# EAGLE design UltrasonicSensor (EAGLE 9.2.2)
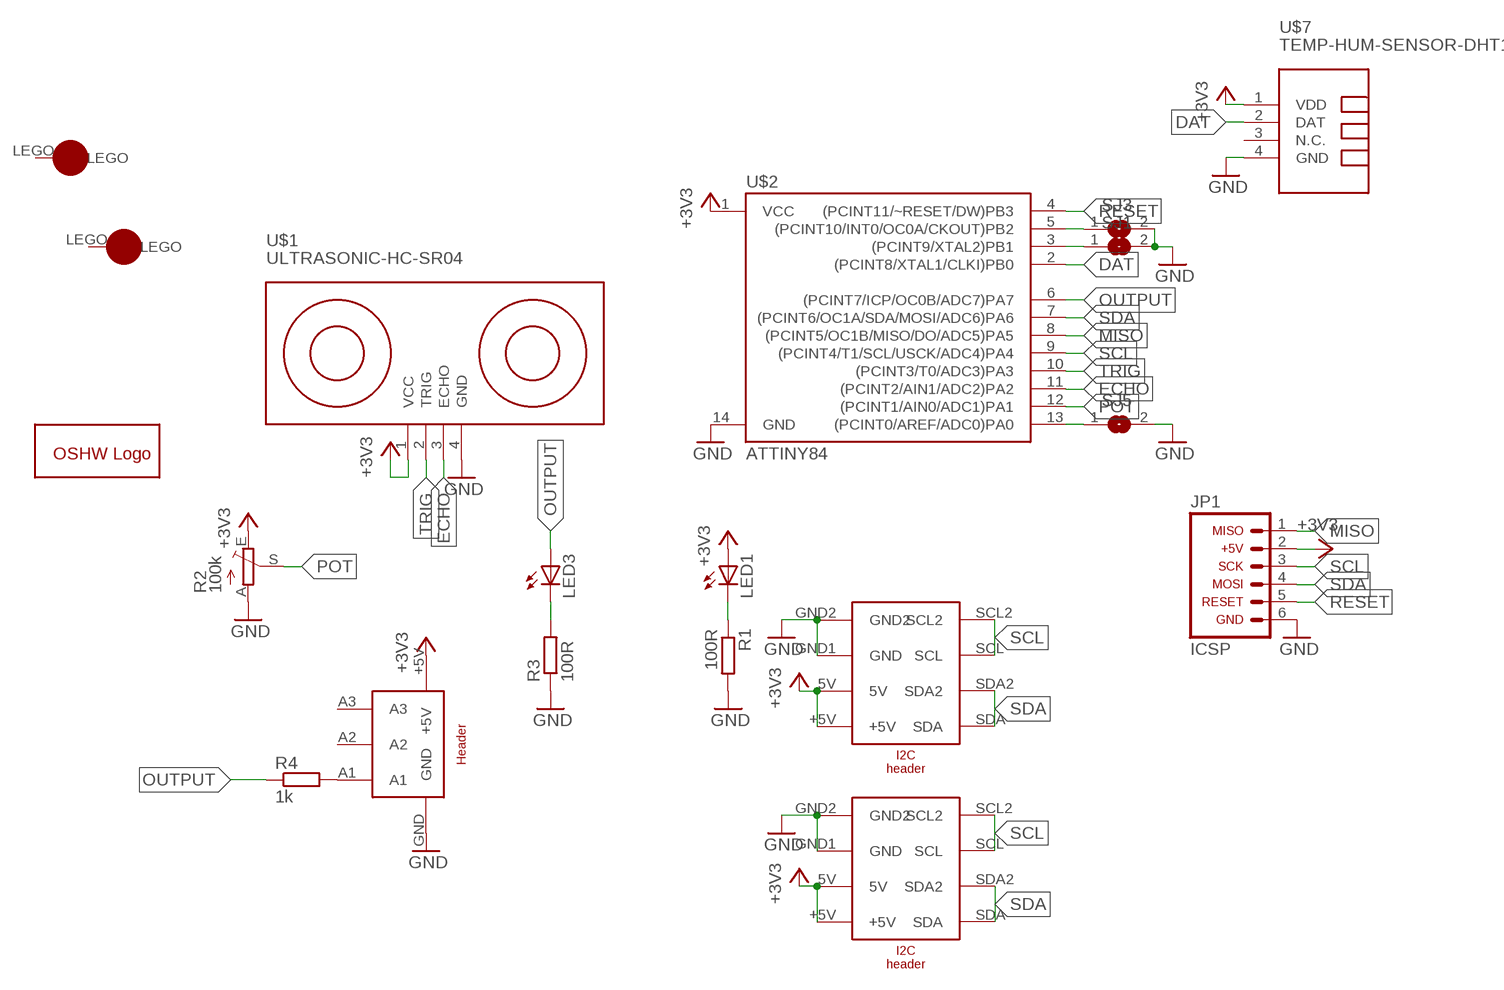
[diagram p0: schematic, sheet 1]

## Parts
JP1  ICSP_HEADER  [ICSP_HEADER]
LED1  LEDCHIPLED_1206  [CHIPLED_1206]
LED3  LEDCHIPLED_1206  [CHIPLED_1206]
R1  100R  R-EU_M1206  [M1206]
R2  100k  TRIM_EU-B64Y  [B64Y]
R3  100R  R-EU_M1206  [M1206]
R4  1k  R-EU_M1206  [M1206]
SJ1  SJ  [SJ]
SJ3  SJ  [SJ]
SJ5  SJ  [SJ]
U$1  ULTRASONIC-HC-SR04  [ULTRASONIC-HC-SR04]
U$2  ATTINY84  [SO14]
U$3  I2C_HEADER  [I2_HEADER]
U$4  I2C_HEADER  [I2_HEADER]
U$5  OPENSOURCE  [OSHW_5MM]
U$6  CONNECTOR_1X5  [CONNECTOR_1X5]
U$7  TEMP-HUM-SENSOR-DHT11  [TEMP-HUM-SENSOR-DHT11]
U$8  LEGO-1X1  [LEGO-1X1]
U$9  LEGO-1X1  [LEGO-1X1]

## Nets
0: SJ5.1 U$2.13((PCINT0/AREF/ADC0)PA0)
8: SJ3.1 U$2.5((PCINT10/INT0/OC0A/CKOUT)PB2)
9: SJ1.1 U$2.3((PCINT9/XTAL2)PB1)
+3V3: JP1.2 LED1.A R2.E U$1.1(VCC) U$2.1(VCC) U$3.5V U$3.+5V U$4.5V U$4.+5V U$6.+5V U$7.1(VDD)
DAT: U$2.2((PCINT8/XTAL1/CLKI)PB0) U$7.2(DAT)
ECHO: U$1.3(ECHO) U$2.11((PCINT2/AIN1/ADC2)PA2)
GND: JP1.6 R1.2 R2.A R3.1 SJ1.2 SJ3.2 SJ5.2 U$1.4(GND) U$2.14(GND) U$3.GND1(GND) U$3.GND2 U$4.GND1(GND) U$4.GND2 U$6.GND U$7.4(GND)
MISO: JP1.1 U$2.8((PCINT5/OC1B/MISO/DO/ADC5)PA5)
N$1: R4.2 U$6.A1
N$10: LED1.C R1.1
N$11: LED3.C R3.2
OUTPUT: LED3.A R4.1 U$2.6((PCINT7/ICP/OC0B/ADC7)PA7)
POT: R2.S U$2.12((PCINT1/AIN0/ADC1)PA1)
RESET: JP1.5 U$2.4((PCINT11/~RESET/DW)PB3)
SCL: JP1.3 U$2.9((PCINT4/T1/SCL/USCK/ADC4)PA4) U$3.SCL U$3.SCL2 U$4.SCL U$4.SCL2
SDA: JP1.4 U$2.7((PCINT6/OC1A/SDA/MOSI/ADC6)PA6) U$3.SDA U$3.SDA2 U$4.SDA U$4.SDA2
TRIG: U$1.2(TRIG) U$2.10((PCINT3/T0/ADC3)PA3)
Unconnected: U$6.A2 U$6.A3 U$7.3(N.C.) U$8.LEGO U$9.LEGO

## Library data of the parts
JP1 = Cing Library:ICSP_HEADER: Arduino ICSP I/O Header This is the ICSP I/O header on the Arduino Uno R3. This connector is labeled with the following pin assignments: MISO +5V SCK MOSI RESET GND NOTE: Be sure you install this connector with the correct orientation on your PCB layout. Pin 1 has a square pad to assist with orientation.
LED1 LED3 = led:LED: LED OSRAM: - CHIPLED LG R971, LG N971, LY N971, LG Q971, LY Q971, LO R971, LY R971 LH N974, LH R974 LS Q976, LO Q976, LY Q976 LO Q996 - Hyper CHIPLED LW Q18S LB Q993, LB Q99A, LB R99A - SideLED LS A670, LO A670, LY A670, LG A670, LP A670 LB A673, LV A673, LT A673, LW A673 LH A674 LY A675 LS A676, LA A676, LO A676, LY A676, LW A676 LS A679, LY A679, LG A679 - Hyper Micro SIDELED® LS Y876, LA Y876, LO Y876, LY Y876 LT Y87S - SmartLED LW L88C, LW L88S LB L89C, LB L89S, LG L890 LS L89K, LO L89K, LY L89K LS L896, LA L896, LO L896, LY L896 - TOPLED LS T670, LO T670, LY T670, LG T670, LP T670 LSG T670, LSP T670, LSY T670, LOP T670, LYG T670 LG T671, LOG T671, LSG T671 LB T673, LV T673, LT T673, LW T673 LH T674 LS T676, LA T676, LO T676, LY T676, LB T676, LH T676, LSB T676, LW T676 LB T67C, LV T67C, LT T67C, LS T67K, LO T67K, LY T67K, LW E67C LS E67B, LA E67B, LO E67B, LY E67B, LB E67C, LV E67C, LT E67C LW T67C LS T679, LY T679, LG T679 LS T770, LO T770, LY T770, LG T770, LP T770 LB T773, LV T773, LT T773, LW T773 LH T774 LS E675, LA E675, LY E675, LS T675 LS T776, LA T776, LO T776, LY T776, LB T776 LHGB T686 LT T68C, LB T68C - Hyper Mini TOPLED® LB M676 - Mini TOPLED Santana® LG M470 LS M47K, LO M47K, LY M47K Source: http://www.osram.convergy.de LUXEON: - LUMILED® LXK2-PW12-R00, LXK2-PW12-S00, LXK2-PW14-U00, LXK2-PW14-V00 LXK2-PM12-R00, LXK2-PM12-S00, LXK2-PM14-U00 LXK2-PE12-Q00, LXK2-PE12-R00, LXK2-PE12-S00, LXK2-PE14-T00, LXK2-PE14-U00 LXK2-PB12-K00, LXK2-PB12-L00, LXK2-PB12-M00, LXK2-PB14-N00, LXK2-PB14-P00, LXK2-PB14-Q00 LXK2-PR12-L00, LXK2-PR12-M00, LXK2-PR14-Q00, LXK2-PR14-R00 LXK2-PD12-Q00, LXK2-PD12-R00, LXK2-PD12-S00 LXK2-PH12-R00, LXK2-PH12-S00 LXK2-PL12-P00, LXK2-PL12-Q00, LXK2-PL12-R00 Source: www.luxeon.com KINGBRIGHT: KA-3528ASYC Source: www.kingbright.com
R1 R3 R4 = rcl:R-EU_: RESISTOR, European symbol; SPICEPREFIX: R
R2 = pot:TRIM_EU-: POTENTIOMETER
SJ1 SJ3 SJ5 = jumper:SJ: SMD solder JUMPER
U$1 = diy-modules:ULTRASONIC-HC-SR04: Ultrasonic Ranging Module HC-SR04 More details available here: http://randomnerdtutorials.com/complete-guide-for-ultrasonic-sensor-hc-sr04/ Click here to find device on ebay.com <http://www.ebay.com/sch/hc+sr04+ultrasonic>
U$2 = SparkFun-IC-Microcontroller:ATTINY84: Atmel 14-pin 2/4/8kB flash uC Datasheet <https://cdn.sparkfun.com/datasheets/Widgets/doc8006.pdf> SparkFun Products Tiny AVR Programmer <https://www.sparkfun.com/products/11801> (PGM-11801) SparkFun Servo Trigger - Continuous Rotation <https://www.sparkfun.com/products/13872> (WIG-13872) SparkFun Servo Trigger <https://www.sparkfun.com/products/13118> (WIG-13118); PROD_ID: IC-11285
U$3 U$4 = Cing Library:I2C_HEADER
U$5 = Cing Library:OPENSOURCE
U$6 = Cing Library:CONNECTOR_1X5
U$7 = diy-modules:TEMP-HUM-SENSOR-DHT11: DHT11 - digital humidity & temperature sensor DHT11 datasheet available here: https://akizukidenshi.com/download/ds/aosong/DHT11.pdf Click here to find device on ebay.com <http://www.ebay.com/sch/dht11+digital+sensor>
U$8 U$9 = Cing Library:LEGO-1X1

## Board
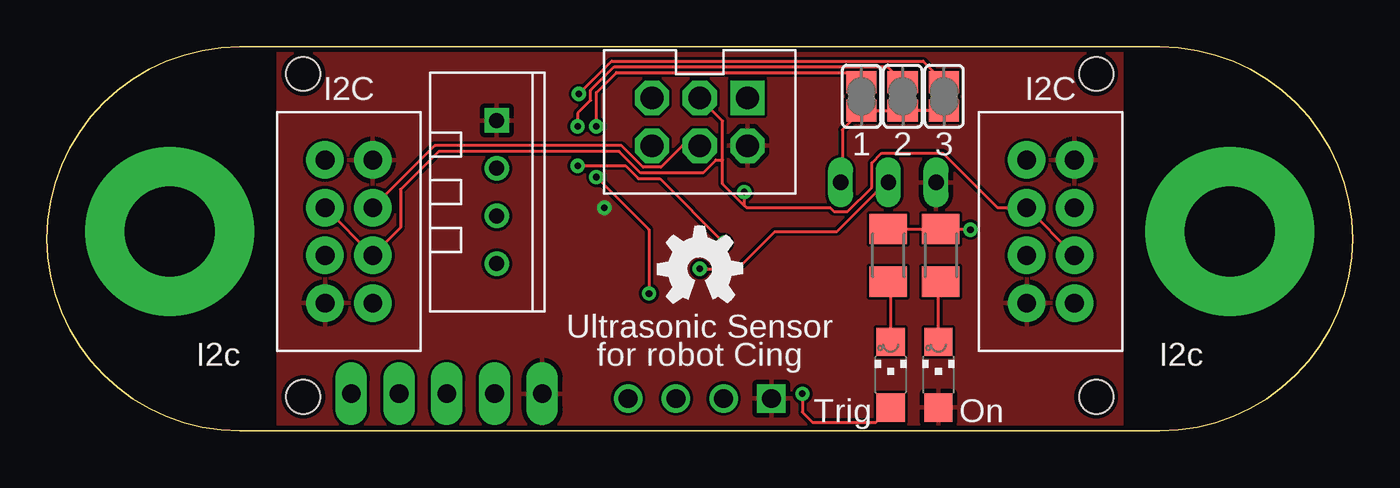
[diagram p1: board, top side]
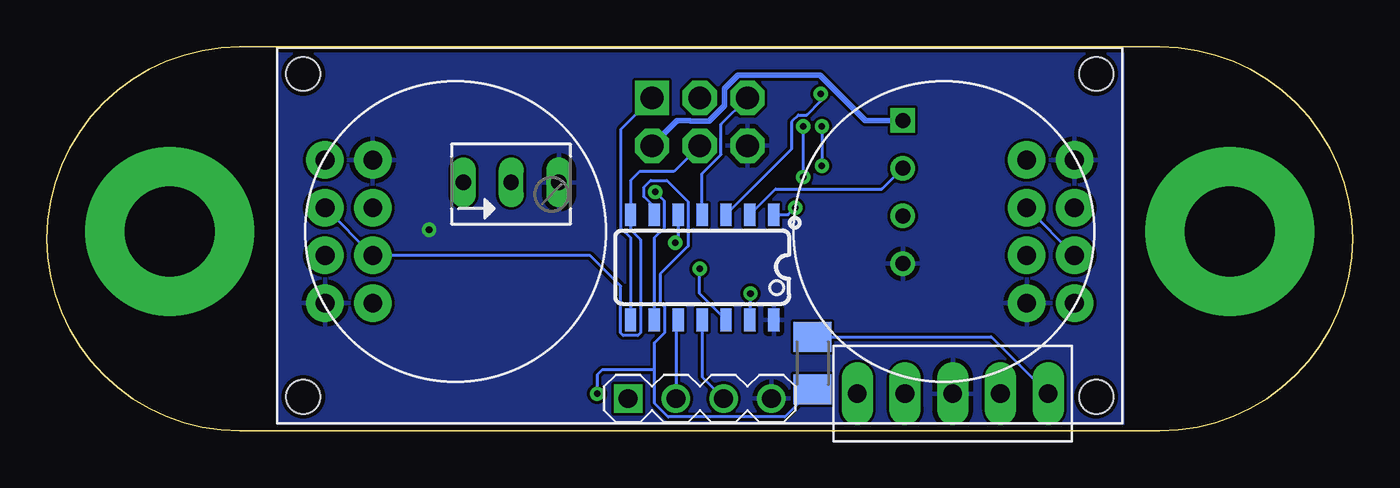
[diagram p2: board, bottom side, seen from below]

Size 69.47 x 20.43 mm. Coordinates in mm from the lower left corner, seen from the top.
Outline: 10.27,0 59.21,0 arc181 59.21,20.43 10.27,20.43 arc181 10.27,0
Copper layers (1*16): Top 0.035mm / dielectric 1.5mm / Bottom 0.035mm
Design rules "default *": minimum track width 6mil, minimum drill 0.35mm, track to track 6mil, track to pad 6mil, pad to pad 6mil, via to via 6mil, smd to smd 6mil, copper to edge 10mil, drill to drill 6mil, minimum pad ring 10mil, minimum via ring 8mil, stop-mask expansion 4mil, vias tented up to drill 0mil, thermal gap 10mil

### Footprints (pad centres in the part's own frame; a part is rotated, then mirrored left to right if it is on the bottom)
ICSP_HEADER = drill 1.2 pad 1.829 square: 1 -1.27,2.54 | drill 1.2 pad 1.829 octagon: 2 1.27,2.54; 3 -1.27,0; 4 1.27,0; 5 -1.27,-2.54; 6 1.27,-2.54
CHIPLED_1206 = smd 1.5 x 1.5: A 0,-1.75; C 0,1.75
M1206 = smd 1.6 x 2: 1 -1.4,0; 2 1.4,0
B64Y = drill 0.813 long: A 2.54,0; E -2.54,0; S 0,0
SJ = smd 1.168 x 1.6: 1 -0.762,0; 2 0.762,0
ULTRASONIC-HC-SR04 = drill 1 square: 1 -3.81,-8.89 | drill 1: 2 -1.27,-8.89; 3 1.27,-8.89; 4 3.81,-8.89 | hole 1.8: -21.1,8.4; -21.1,-8.8; 21.1,-8.8; 21.1,8.4
SO14 = smd 0.6 x 1.2: 1 -3.175,-2.8; 2 -1.905,-2.8; 3 -0.635,-2.8; 4 0.635,-2.8; 5 1.905,-2.8; 6 3.175,-2.8; 7 4.445,-2.8; 8 4.445,2.8; 9 3.175,2.8; 10 1.905,2.8; 11 0.635,2.8; 12 -0.635,2.8; 13 -1.905,2.8; 14 -3.175,2.8
I2_HEADER = drill 1 pad 2: 5V 1.27,3.81; +5V -1.27,-3.81; GND1 -1.27,3.81; GND2 1.27,-3.81; SCL 1.27,-1.27; SCL2 -1.27,1.27; SDA 1.27,1.27; SDA2 -1.27,-1.27
CONNECTOR_1X5 = drill 1 pad 1.676 long: +5V 0,-5.08; A1 0,5.08; A2 0,2.54; A3 0,-2.54; GND 0,0
TEMP-HUM-SENSOR-DHT11 = drill 0.8 square: 1 -3.81,0 | drill 0.8: 2 -1.27,0; 3 1.27,0; 4 3.81,0
LEGO-1X1 = drill 4.8 pad 9: LEGO 0,0

### Placement (x,y rotation side)
JP1  34.74,16.44 270 top
LED1  47.44,2.98 0 top
LED3  44.9,2.98 0 top
R1  47.56,9.33 90 top
R2  44.78,13.22 0 bottom
R3  44.77,9.33 270 top
R4  28.74,3.6 90 bottom
SJ1  47.74,17.8 270 top
SJ3  45.54,17.8 270 top
SJ5  43.34,17.8 270 top
U$1  34.74,10.6 0 bottom
U$2  33.97,8.7 180 bottom
U$3  16.07,10.6 0 top
U$4  53.4,10.6 0 top
U$5  34.74,8.6 0 top
U$6  21.27,1.97 270 bottom
U$7  23.94,12.7 270 top
U$8  6.54,10.6 0 top
U$9  62.94,10.6 0 top

### Tracks (layer width: path | path; a pad name or v marks a point on that pad's centre or on a via)
0  (via drill 0.35)
  Top 0.152: v29.24,16.2 29.24,18 30.31,19.07 42.83,19.07 SJ5.1 | v29.24,13.5 32.04,10.7 v32.04,7.3
  Bottom 0.152: v29.24,16.2 v29.24,13.5 | v32.04,7.3 32.07,7.27 U$2.13
8  (via drill 0.35)
  Top 0.152: v28.24,16.2 28.24,16.9 28.93,17.59 28.93,18.13 30.18,19.38 44.72,19.38 SJ3.1 | v28.24,14.1 28.98,14.1 28.98,14.11 30.78,14.11 31.47,13.42 32.62,13.42 v36.04,10
  Bottom 0.152: v28.24,16.2 v28.24,14.1 | v36.04,10 35.88,10.16 U$2.5
9  (via drill 0.35)
  Top 0.152: SJ1.1 46.62,19.68 30.05,19.68 v28.3,17.93
  Bottom 0.152: U$2.3 29.84,14.99 29.84,16.45 29.49,16.81 29.04,16.81 28.3,17.54 v28.3,17.93
+3V3  (via drill 0.35)
  Bottom 0.152: U$2.1 30.03,11.49 v29.66,11.87
  Bottom 0.305: JP1.2 35.94,16.51 35.26,16.51 35.24,16.49 34.23,16.49 33.41,17.31 33.41,18.22 32.7,18.93 28.34,18.93 25.92,16.51 U$7.1
  pour Top: 12.31,23.3 57.21,23.3 57.21,-2.1 12.31,-2.1
DAT
  Bottom 0.152: U$2.2 30.7,12.86 25.04,12.86 U$7.2
ECHO
  Bottom 0.152: U$2.11 34.61,2.85 U$1.3
GND  (via drill 0.35)
  Top 0.152: R3.1 R1.2 49.11,10.73 v49.14,10.7 | SJ1.2 SJ3.2 SJ5.2 42.32,16.02 42.32,13.3 R2.A
  pour Bottom: 12.21,20.76 57.17,20.76 57.17,-0.83 12.21,-0.83
MISO
  Bottom 0.152: U$2.8 38.42,10.27 38.95,10.8 38.95,16.04 JP1.1
N$1
  Bottom 0.152: R4.2 19.22,5 U$6.A1
N$10
  Top 0.152: LED1.C 47.44,7.8 R1.1
N$11
  Top 0.152: LED3.C 44.9,7.8 R3.2
OUTPUT  (via drill 0.35)
  Top 0.152: LED3.A 44.11,0.44 40.74,0.44 40.2,0.98 v40.2,1.96
  Bottom 0.152: U$2.6 37.15,11.9 37.71,12.46 37.71,12.96 37.35,13.32 36.48,13.32 35.35,12.19 35.35,9.83 36.84,8.33 36.84,6.81 36.62,6.59 36.62,5.2 37.15,4.67 37.15,3.23 | R4.1 30.21,0.73 36.41,0.73 37.15,1.46 37.15,3.23 | 37.15,3.23 39.94,3.23 40.2,2.98 v40.2,1.96
POT  (via drill 0.35)
  Top 0.152: v34.74,8.62 36.75,8.62 38.74,10.6 42.04,10.6 44.66,13.22 R2.S
  Bottom 0.152: U$2.12 34.74,7.29 v34.74,8.62
RESET
  Bottom 0.152: U$2.4 34.61,13.68 33.59,14.7 33.59,16.31 JP1.5
SCL  (via drill 0.35)
  Top 0.152: v37.1,12.71 37.1,12 | 35.96,14.41 35.96,13.14 37.1,12 | 35.96,14.41 35.96,16.49 JP1.3 | U$3.SCL2 U$3.SCL 18.82,10.81 18.82,12.84 20.84,14.87 30.45,14.87 31.6,13.72 34.9,13.72 35.59,14.41 35.96,14.41 | U$4.SCL U$4.SCL2 52.13,11.9 52.1,11.87 50.58,11.87 47.68,14.77 44.41,14.77 43.89,14.25 43.89,12.95 42.6,11.67 41.87,11.67 41.67,11.87 37.23,11.87 37.1,12
  Bottom 0.152: U$2.9 37.15,10.27 36.62,10.8 36.62,12.23 v37.1,12.71
SDA
  Top 0.152: U$3.SDA 20.64,15.17 30.58,15.17 31.72,14.03 32.67,14.03 33.81,15.17 JP1.4
  Bottom 0.152: U$3.SDA U$3.SDA2 | U$4.SDA U$4.SDA2 40.58,9.33 38.95,7.69 38.95,5.2 38.81,5.07 38.02,5.07 37.89,5.2 37.89,10.17 38.42,10.7 U$2.7 38.42,13.32 37.94,13.8 36.11,13.8 JP1.4
TRIG
  Bottom 0.152: U$2.10 36.01,5.77 U$1.2

### Text on the board
tPlace: 1 | 2 | 3 | Ultrasonic Sensor | I2c | for robot Cing | I2c | Trig | On